# Altium project MARCS_PCB_Project.PrjPcb
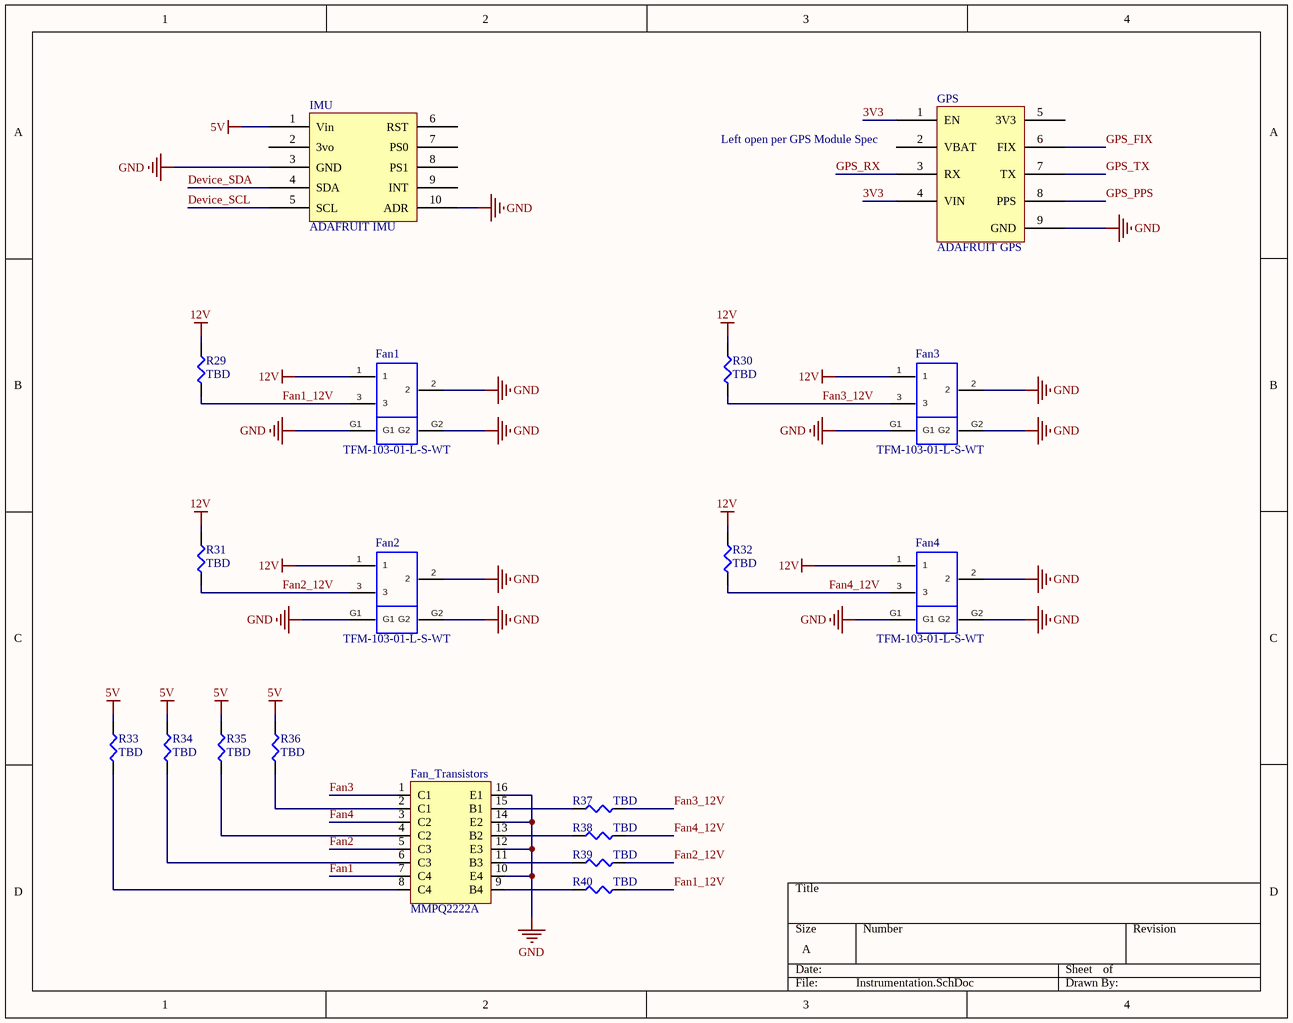
[diagram p0: Instrumentation.SchDoc]
6 sheets, 128 parts. Net scope: global (net labels, ports and power ports of the same name join across sheets).
Board file: MARCS.PcbDoc
Sheets:
  Instrumentation.SchDoc
  MotorControl_Sch.SchDoc
  Power.SchDoc
  PowerMonitoring.SchDoc
  Sensors_Sch.SchDoc
  STM32 Schematic V1.SchDoc

## Sheet Instrumentation.SchDoc
size A

### Parts
Fan1  TFM-103-01-L-S-WT  [TFM-103-01-L-S-WT]
Fan2  TFM-103-01-L-S-WT  [TFM-103-01-L-S-WT]
Fan3  TFM-103-01-L-S-WT  [TFM-103-01-L-S-WT]
Fan4  TFM-103-01-L-S-WT  [TFM-103-01-L-S-WT]
Fan_Transistors  MMPQ2222A  [MMPQ2222A]
GPS  ADAFRUIT GPS  [ADAFRUIT ULTIMATE GPS]
IMU  ADAFRUIT IMU  [ADAFRUIT IMU]
R29  TBD  [0805R-GENERIC]
R30  TBD  [0805R-GENERIC]
R31  TBD  [0805R-GENERIC]
R32  TBD  [0805R-GENERIC]
R33  TBD  [0805R-GENERIC]
R34  TBD  [0805R-GENERIC]
R35  TBD  [0805R-GENERIC]
R36  TBD  [0805R-GENERIC]
R37  TBD  [0805R-GENERIC]
R38  TBD  [0805R-GENERIC]
R39  TBD  [0805R-GENERIC]
R40  TBD  [0805R-GENERIC]

### Nets
3V3: GPS.1(EN) GPS.4(VIN)
5V: IMU.1(Vin) R33.1 R34.1 R35.1 R36.1
12V: Fan1.1 Fan2.1 Fan3.1 Fan4.1 R29.1 R30.1 R31.1 R32.1
GND: Fan1.2 Fan1.G1 Fan1.G2 Fan2.2 Fan2.G1 Fan2.G2 Fan3.2 Fan3.G1 Fan3.G2 Fan4.2 Fan4.G1 Fan4.G2 Fan_Transistors.10(E4) Fan_Transistors.12(E3) Fan_Transistors.14(E2) Fan_Transistors.16(E1) GPS.9(GND) IMU.3(GND) IMU.10(ADR)
Device_SCL: IMU.5(SCL)
Device_SDA: IMU.4(SDA)
Fan1: Fan_Transistors.7(C4)
Fan1_12V: Fan1.3 R29.2 R40.2
Fan2: Fan_Transistors.5(C3)
Fan2_12V: Fan2.3 R31.2 R39.2
Fan3: Fan_Transistors.1(C1)
Fan3_12V: Fan3.3 R30.2 R37.2
Fan4: Fan_Transistors.3(C2)
Fan4_12V: Fan4.3 R32.2 R38.2
GPS_FIX: GPS.6(FIX)
GPS_PPS: GPS.8(PPS)
GPS_RX: GPS.3(RX)
GPS_TX: GPS.7(TX)
NetFan_Transistors_2: Fan_Transistors.2(C1) R36.2
NetFan_Transistors_4: Fan_Transistors.4(C2) R35.2
NetFan_Transistors_6: Fan_Transistors.6(C3) R34.2
NetFan_Transistors_8: Fan_Transistors.8(C4) R33.2
NetFan_Transistors_9: Fan_Transistors.9(B4) R40.1
NetFan_Transistors_11: Fan_Transistors.11(B3) R39.1
NetFan_Transistors_13: Fan_Transistors.13(B2) R38.1
NetFan_Transistors_15: Fan_Transistors.15(B1) R37.1

Not connected (* = marked no-connect by the designer): GPS 2(VBAT) 5(3V3); IMU 2(3vo) 6(RST) 7(PS0) 8(PS1) 9(INT)

### Notes on the sheet
- (near GPS) Left open per GPS Module Spec

### Library data of the parts
R29-R40 = 0805R-TBD: RESISTOR 0805 VALUE TO BE DETERMINED
Fan_Transistors = MMPQ2222A: Supplier 1: Arrow; Supplier Part Number 1: MMPQ2222A
GPS = ADAFRUIT GPS: Supplier 1: Digi-Key; Supplier Part Number 1: 1528-1153-ND
IMU = ADAFRUIT IMU: Supplier 1: Arrow; Supplier Part Number 1: 2472

## Sheet MotorControl_Sch.SchDoc
size B
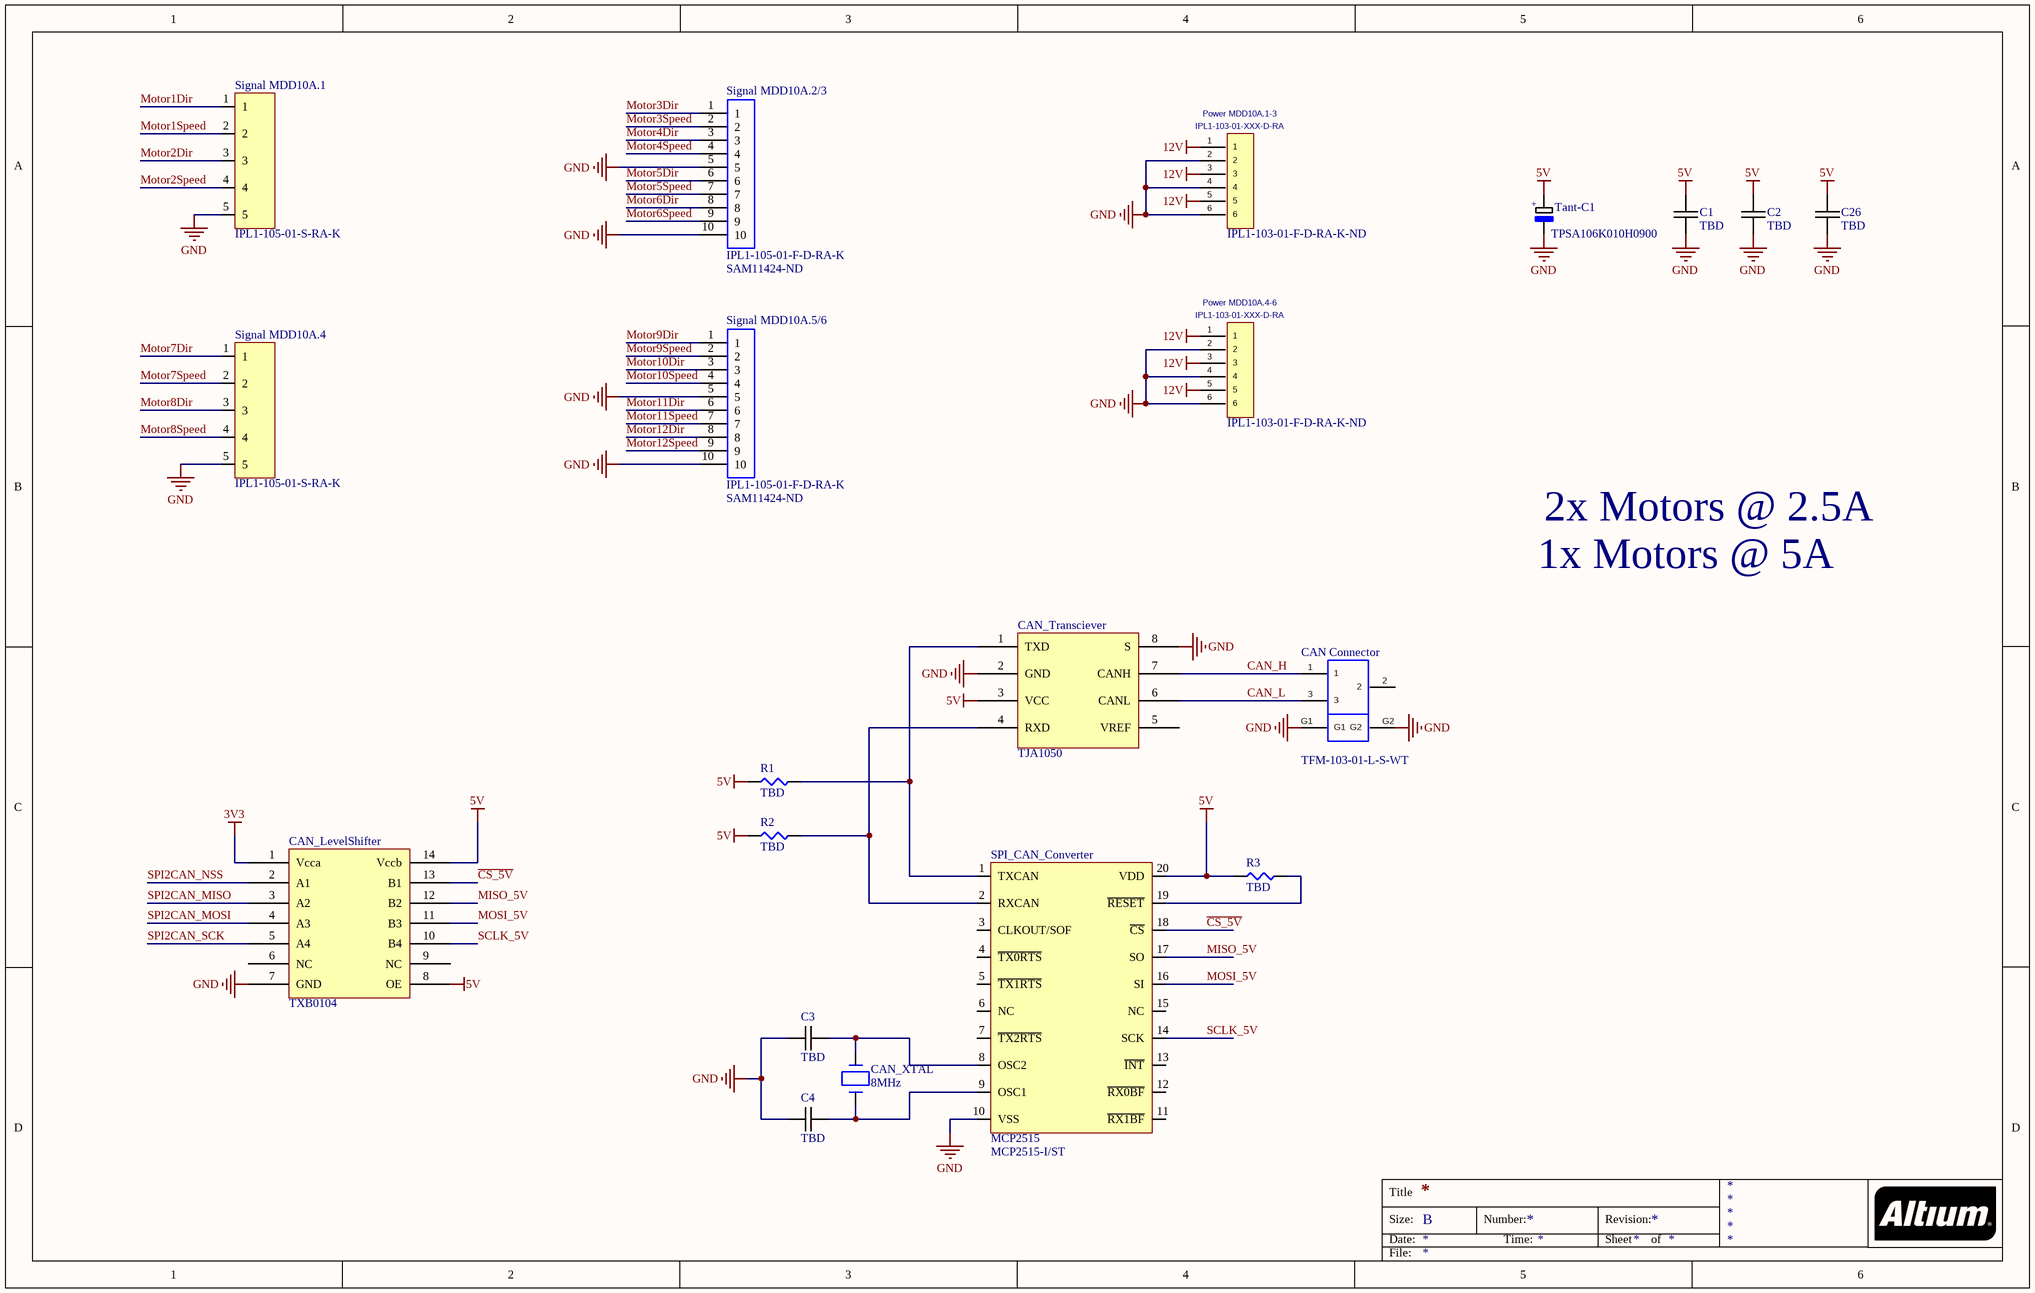
[diagram p1: MotorControl_Sch.SchDoc]

### Parts
C1  TBD  [0805C-GENERIC]
C2  TBD  [0805C-GENERIC]
C3  TBD  [0805C-GENERIC]
C4  TBD  [0805C-GENERIC]
C26  TBD  [0805C-GENERIC]
CAN_Connector  TFM-103-01-L-S-WT  [TFM-103-01-L-S-WT]
CAN_LevelShifter  TXB0104  [TXB0104]
CAN_Transciever  TJA1050  [TJA1050]
CAN_XTAL  8MHz  [GC0800044]
Power_MDD10A.1-3  IPL1-103-01-XXX-D-RA  Supplier Part Number 1: IPL1-103-01-F-D-RA-K-ND  [IPL1-103-01-XXX-D-RA]
Power_MDD10A.4-6  IPL1-103-01-XXX-D-RA  Supplier Part Number 1: IPL1-103-01-F-D-RA-K-ND  [IPL1-103-01-XXX-D-RA]
R1  TBD  [0805R-GENERIC]
R2  TBD  [0805R-GENERIC]
R3  TBD  [0805R-GENERIC]
Signal_MDD10A.1  IPL1-105-01-S-RA-K  [IPL1-105-01-S-RA-K]
Signal_MDD10A.2/3  IPL1-105-01-F-D-RA-K  Supplier Part Number 1: SAM11424-ND  [IPL1-105-01-F-D-RA-K]
Signal_MDD10A.4  IPL1-105-01-S-RA-K  [IPL1-105-01-S-RA-K]
Signal_MDD10A.5/6  IPL1-105-01-F-D-RA-K  Supplier Part Number 1: SAM11424-ND  [IPL1-105-01-F-D-RA-K]
SPI_CAN_Converter  MCP2515  Supplier Part Number 1: MCP2515-I/ST  [TSSOP20]
Tant-C1  TPSA106K010H0900  [TPSA106K010H0900]

### Nets
3V3: CAN_LevelShifter.1(Vcca)
5V: C1.1 C2.1 C26.1 CAN_LevelShifter.8(OE) CAN_LevelShifter.14(Vccb) CAN_Transciever.3(VCC) R1.1 R2.1 R3.1 SPI_CAN_Converter.20(VDD) Tant-C1.1(POS)
12V: Power_MDD10A.1-3.1 Power_MDD10A.1-3.3 Power_MDD10A.1-3.5 Power_MDD10A.4-6.1 Power_MDD10A.4-6.3 Power_MDD10A.4-6.5
GND: C1.2 C2.2 C3.1 C4.1 C26.2 CAN_Connector.G1 CAN_Connector.G2 CAN_LevelShifter.7(GND) CAN_Transciever.2(GND) CAN_Transciever.8(S) Power_MDD10A.1-3.2 Power_MDD10A.1-3.4 Power_MDD10A.1-3.6 Power_MDD10A.4-6.2 Power_MDD10A.4-6.4 Power_MDD10A.4-6.6 Signal_MDD10A.1.5 Signal_MDD10A.2/3.5 Signal_MDD10A.2/3.10 Signal_MDD10A.4.5 Signal_MDD10A.5/6.5 Signal_MDD10A.5/6.10 SPI_CAN_Converter.10(VSS) Tant-C1.2(NEG)
~{CS_5V}: CAN_LevelShifter.13(B1) SPI_CAN_Converter.18(~{CS})
CAN_H: CAN_Connector.1 CAN_Transciever.7(CANH)
CAN_L: CAN_Connector.3 CAN_Transciever.6(CANL)
MISO_5V: CAN_LevelShifter.12(B2) SPI_CAN_Converter.17(SO)
MOSI_5V: CAN_LevelShifter.11(B3) SPI_CAN_Converter.16(SI)
Motor1Dir: Signal_MDD10A.1.1
Motor1Speed: Signal_MDD10A.1.2
Motor2Dir: Signal_MDD10A.1.3
Motor2Speed: Signal_MDD10A.1.4
Motor3Dir: Signal_MDD10A.2/3.1
Motor3Speed: Signal_MDD10A.2/3.2
Motor4Dir: Signal_MDD10A.2/3.3
Motor4Speed: Signal_MDD10A.2/3.4
Motor5Dir: Signal_MDD10A.2/3.6
Motor5Speed: Signal_MDD10A.2/3.7
Motor6Dir: Signal_MDD10A.2/3.8
Motor6Speed: Signal_MDD10A.2/3.9
Motor7Dir: Signal_MDD10A.4.1
Motor7Speed: Signal_MDD10A.4.2
Motor8Dir: Signal_MDD10A.4.3
Motor8Speed: Signal_MDD10A.4.4
Motor9Dir: Signal_MDD10A.5/6.1
Motor9Speed: Signal_MDD10A.5/6.2
Motor10Dir: Signal_MDD10A.5/6.3
Motor10Speed: Signal_MDD10A.5/6.4
Motor11Dir: Signal_MDD10A.5/6.6
Motor11Speed: Signal_MDD10A.5/6.7
Motor12Dir: Signal_MDD10A.5/6.8
Motor12Speed: Signal_MDD10A.5/6.9
SCLK_5V: CAN_LevelShifter.10(B4) SPI_CAN_Converter.14(SCK)
SPI2CAN_MISO: CAN_LevelShifter.3(A2)
SPI2CAN_MOSI: CAN_LevelShifter.4(A3)
SPI2CAN_NSS: CAN_LevelShifter.2(A1)
SPI2CAN_SCK: CAN_LevelShifter.5(A4)
NetC3_2: C3.2 CAN_XTAL.1 SPI_CAN_Converter.8(OSC2)
NetC4_2: C4.2 CAN_XTAL.2 SPI_CAN_Converter.9(OSC1)
NetCAN_Transciever_1: CAN_Transciever.1(TXD) R1.2 SPI_CAN_Converter.1(TXCAN)
NetCAN_Transciever_4: CAN_Transciever.4(RXD) R2.2 SPI_CAN_Converter.2(RXCAN)
NetR3_2: R3.2 SPI_CAN_Converter.19(~{RESET})

Not connected (* = marked no-connect by the designer): CAN_Connector 2; CAN_LevelShifter 6(NC) 9(NC); CAN_Transciever 5(VREF); SPI_CAN_Converter 3(CLKOUT/SOF) 4(~{TX0RTS}) 5(~{TX1RTS}) 6(NC) 7(~{TX2RTS}) 11(~{RX1BF}) 12(~{RX0BF}) 13(~{INT}) 15(NC)

### Notes on the sheet
- 2x Motors @ 2.5A
- 1x Motors @ 5A
- Title
- Size:
- Date:
- B
- Number:
- Time:
- Revision:
- Sheet
- of
- File:
- (in symbol TPSA106K010H0900) +

### Library data of the parts
C1-C4 C26 = 0805C-TBD: CAPACITOR 0805 CERAMIC VALUE TO BE DETERMINED
CAN_XTAL = GC0800044: Diodes Incorporated GC0800044; Supplier 1: Digi-Key; Supplier Part Number 1: GC0800044TR-ND
Power_MDD10A.1-3 Power_MDD10A.4-6 = IPL1-103-01-XXX-D-RA: Terminal Assembly, Double Row, Right Angle, Thru-Hole, 0.100" x 0.100" Pitch, 6Pins; MANUFACTURER: SAMTEC; CREATED: July 16, 2014 - Wendy Xin; PCB DECAL: IPL1-103-01-XXX-D-RA; Supplier 1: Digi-Key
R1-R3 = 0805R-TBD: RESISTOR 0805 VALUE TO BE DETERMINED
Signal_MDD10A.2/3 Signal_MDD10A.5/6 = IPL1-105-01-F-D-RA-K: Supplier 1: Digi-Key
SPI_CAN_Converter = MCP2515: Supplier 1: Arrow

## Sheet Power.SchDoc
size B
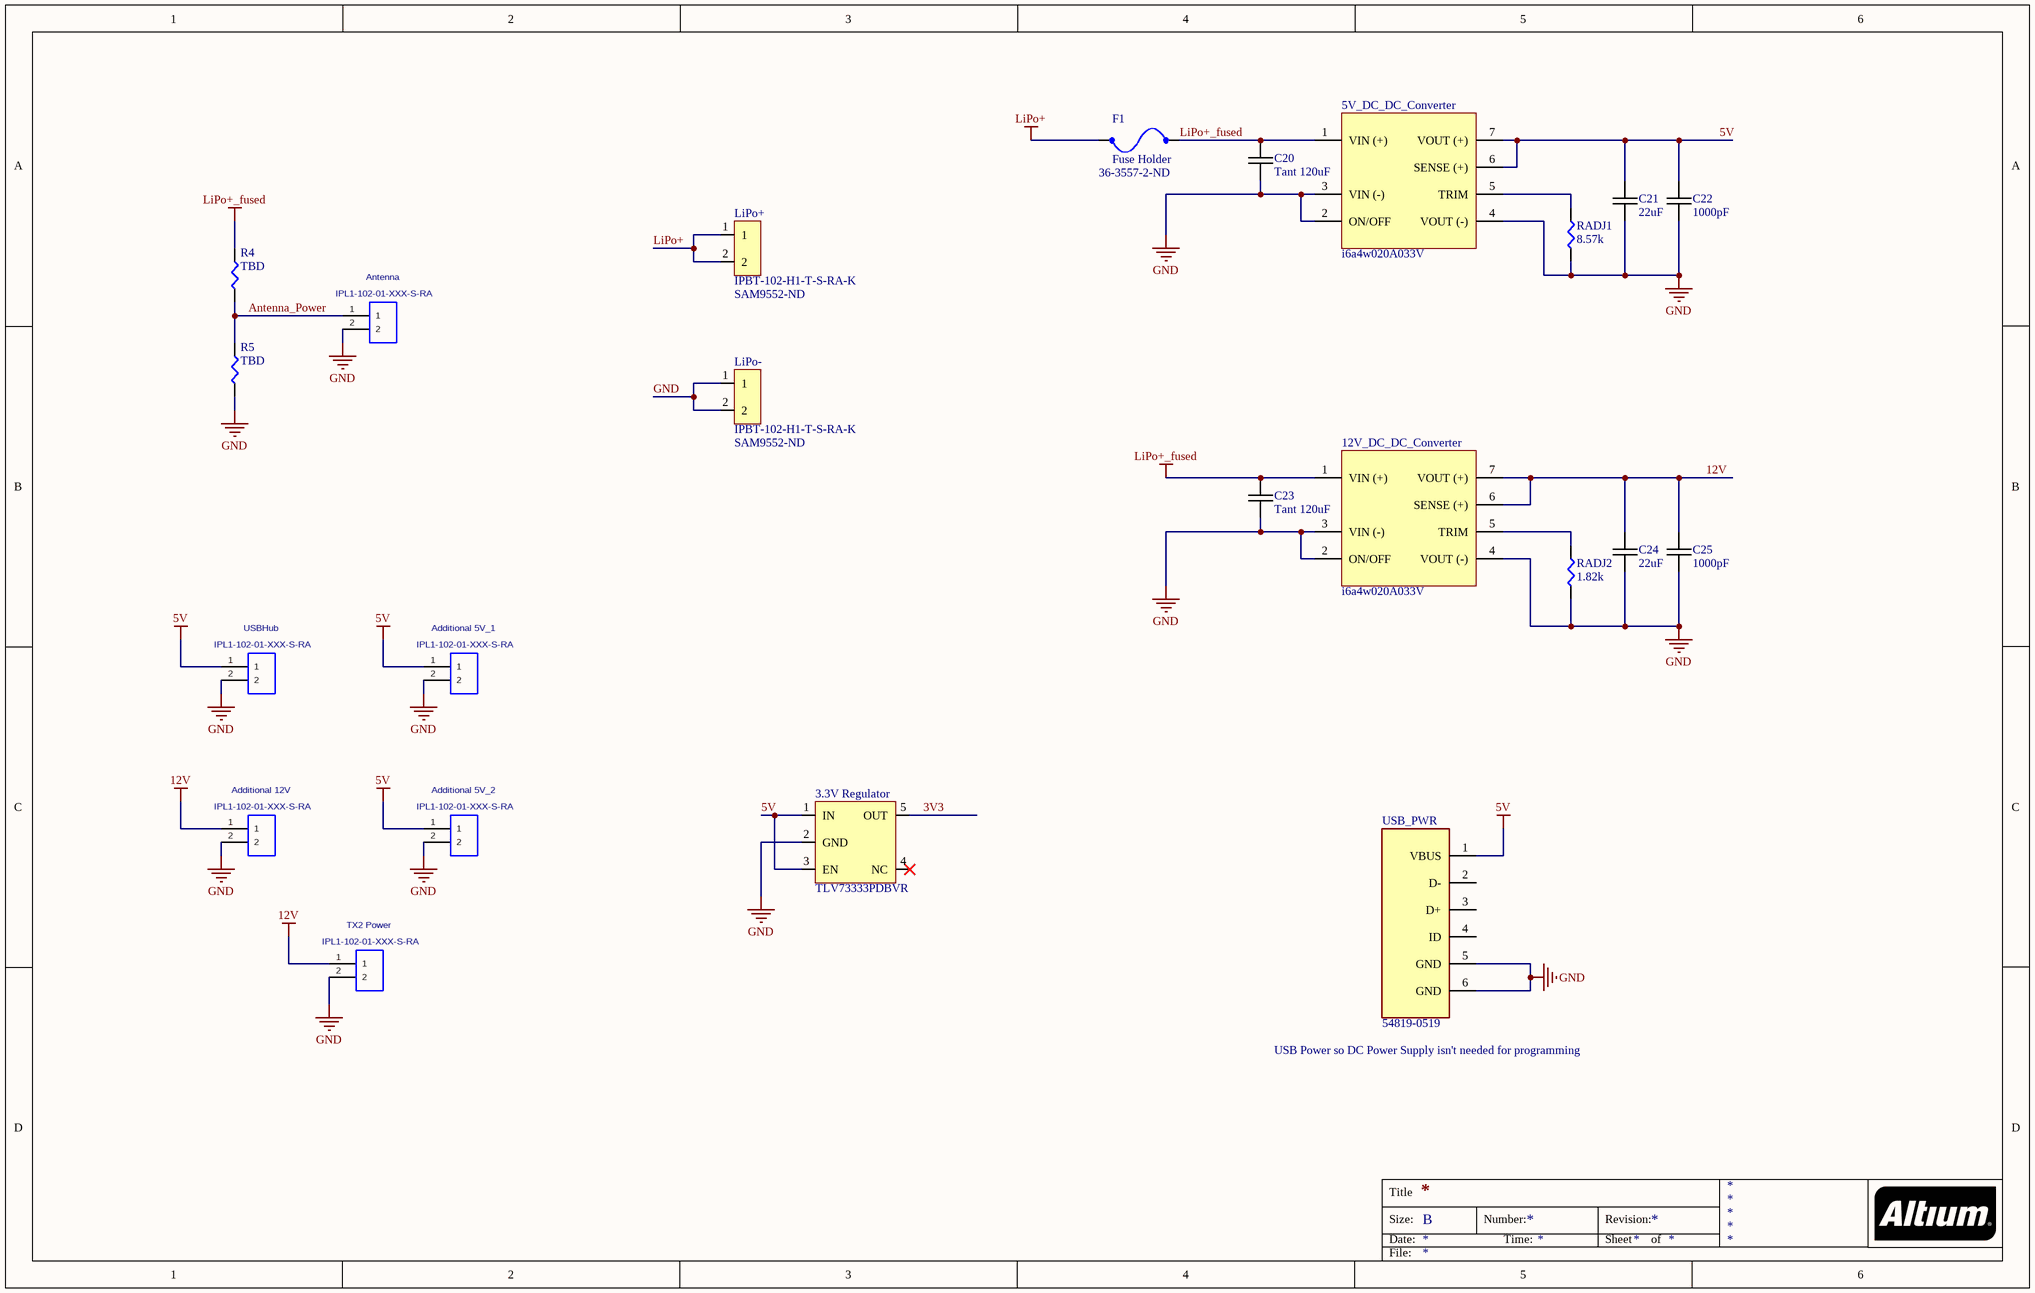
[diagram p2: Power.SchDoc]

### Parts
3.3V_Regulator  TLV73333PDBVR  [TLV733P]
5V_DC_DC_Converter  i6a4w020A033V  [i6a4w020A033V-001-R]
12V_DC_DC_Converter  i6a4w020A033V  [i6a4w020A033V-001-R]
Additional_5V_1  IPL1-102-01-XXX-S-RA  [IPL1-102-01-XXX-S-RA]
Additional_5V_2  IPL1-102-01-XXX-S-RA  [IPL1-102-01-XXX-S-RA]
Additional_12V  IPL1-102-01-XXX-S-RA  [IPL1-102-01-XXX-S-RA]
Antenna  IPL1-102-01-XXX-S-RA  [IPL1-102-01-XXX-S-RA]
C20  Tant 120uF  [0805C-GENERIC]
C21  22uF  [0805C-GENERIC]
C22  1000pF  [0805C-GENERIC]
C23  Tant 120uF  [0805C-GENERIC]
C24  22uF  [0805C-GENERIC]
C25  1000pF  [0805C-GENERIC]
F1  Fuse Holder  Supplier Part Number 1: 36-3557-2-ND  [Fuse Holder]
LiPo+  IPBT-102-H1-T-S-RA-K  Supplier Part Number 1: SAM9552-ND  [IPBT-102-H1-T-S-RA-K]
LiPo-  IPBT-102-H1-T-S-RA-K  Supplier Part Number 1: SAM9552-ND  [IPBT-102-H1-T-S-RA-K]
R4  TBD  [0805R-GENERIC]
R5  TBD  [0805R-GENERIC]
RADJ1  8.57k  [0805R-GENERIC]
RADJ2  1.82k  [0805R-GENERIC]
TX2_Power  IPL1-102-01-XXX-S-RA  [IPL1-102-01-XXX-S-RA]
USB_PWR  Part Number: 54819-0519  [Molex_54819-0519_0]  (hidden comment: Conn_Molex_54819-0519_eec)
USBHub  IPL1-102-01-XXX-S-RA  [IPL1-102-01-XXX-S-RA]

### Nets
3V3: 3.3V_Regulator.5(OUT)
5V: 3.3V_Regulator.1(IN) 3.3V_Regulator.3(EN) 5V_DC_DC_Converter.6(SENSE_(+)) 5V_DC_DC_Converter.7(VOUT_(+)) Additional_5V_1.1 Additional_5V_2.1 C21.1 C22.1 USB_PWR.1(VBUS) USBHub.1
12V: 12V_DC_DC_Converter.6(SENSE_(+)) 12V_DC_DC_Converter.7(VOUT_(+)) Additional_12V.1 C24.1 C25.1 TX2_Power.1
GND: 3.3V_Regulator.2(GND) 5V_DC_DC_Converter.2(ON/OFF) 5V_DC_DC_Converter.3(VIN_(-)) 5V_DC_DC_Converter.4(VOUT_(-)) 12V_DC_DC_Converter.2(ON/OFF) 12V_DC_DC_Converter.3(VIN_(-)) 12V_DC_DC_Converter.4(VOUT_(-)) Additional_5V_1.2 Additional_5V_2.2 Additional_12V.2 Antenna.2 C20.2 C21.2 C22.2 C23.2 C24.2 C25.2 LiPo-.1 LiPo-.2 R5.1 RADJ1.2 RADJ2.2 TX2_Power.2 USB_PWR.5(GND) USB_PWR.6(GND) USBHub.2
LiPo+: F1.1 LiPo+.1 LiPo+.2
LiPo+_fused: 5V_DC_DC_Converter.1(VIN_(+)) 12V_DC_DC_Converter.1(VIN_(+)) C20.1 C23.1 F1.2 R4.2
Antenna_Power: Antenna.1 R4.1 R5.2
Net5V_DC_DC_Converter_5: 5V_DC_DC_Converter.5(TRIM) RADJ1.1
Net12V_DC_DC_Converter_5: 12V_DC_DC_Converter.5(TRIM) RADJ2.1

Not connected (* = marked no-connect by the designer): 3.3V_Regulator 4(NC)*; USB_PWR 2(D-) 3(D+) 4(ID)

### Notes on the sheet
- USB Power so DC Power Supply isn't needed for programming
- Title
- Size:
- Date:
- B
- Number:
- Time:
- Revision:
- Sheet
- of
- File:

### Library data of the parts
3.3V_Regulator = TLV733
5V_DC_DC_Converter 12V_DC_DC_Converter = i6a4w020A033V-001-R: TDK-Lambda DC/DC Converter; Supplier 1: Digi-Key; Supplier Part Number 1: i6a4w020A033V
Additional_5V_1 Additional_5V_2 Additional_12V Antenna TX2_Power USBHub = IPL1-102-01-XXX-S-RA: Terminal Assembly, Single Row, Right Angle, Thru-Hole, 2 Pins.; MANUFACTURER: SAMTEC; CREATED: February 14, 2016 - Wendy Xin; PCB DECAL: IPL1-102-01-XXX-S-RA
C20-C25 = 0805C-TBD: as C1 on sheet MotorControl_Sch
R4 R5 RADJ1 RADJ2 = 0805R-TBD: RESISTOR 0805 VALUE TO BE DETERMINED
USB_PWR = Conn_Molex_54819-0519_eec: CONN USB - mini B USB 2.0 OTG Receptacle Connector 5 Position Through Hole, Right Angle; Manufacturer: Molex; Is Female: yes; helpURL: https://upverter.com/upn/revision/57f7d65304c3d878/; ComponentLink2Description: Datasheet; Temperature: -20°C to +85°C; Package: CONN_PTH_7MM7_9MM0_USB; Supplier 2: Mouser; Supplier 1: Digi-Key; ComponentLink1URL: https://upverter.com/upn/revision/57f7d65304c3d878/; Supplier Part Number 2: 538-54819-0519; Supplier Part Number 1: WM17115-ND; ComponentLink1Description: Upverter; ComponentLink2URL: https://upverter.com/datasheet/9d71f2f8719b3fc0715bd6f9e6d9d5a5d296bb87.pdf; RoHS: TRUE; Mouser Part Number: 538-54819-0519; Temperature Range High: +85°C; Digikey Description: CONN USB - mini B USB 2.0 OTG Receptacle Connector 5 Position Through Hole, Right Angle; Digikey Part Number: WM17115-ND; Lead Free: yes; Temperature Range Low: -20°C
F1 = Fuse Holder: Supplier 1: Digi-Key
LiPo+ LiPo- = IPBT-102-H1-T-S-RA-K: Supplier 1: Digi-Key

## Sheet PowerMonitoring.SchDoc
size B
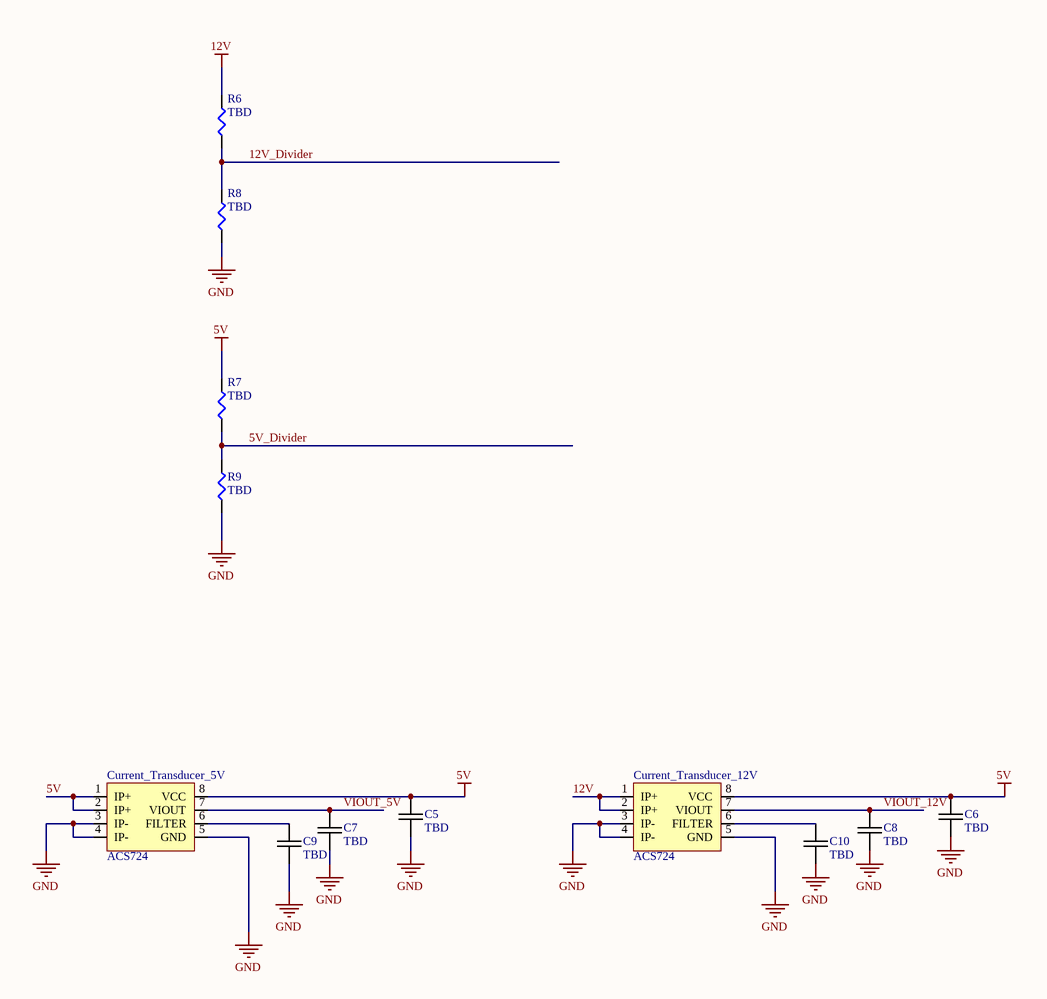
[diagram p3: PowerMonitoring.SchDoc]

### Parts
C5  TBD  [0805C-GENERIC]
C6  TBD  [0805C-GENERIC]
C7  TBD  [0805C-GENERIC]
C8  TBD  [0805C-GENERIC]
C9  TBD  [0805C-GENERIC]
C10  TBD  [0805C-GENERIC]
Current_Transducer_5V  ACS724  [SOIC-8 V3]
Current_Transducer_12V  ACS724  [SOIC-8 V3]
R6  TBD  [0805R-GENERIC]
R7  TBD  [0805R-GENERIC]
R8  TBD  [0805R-GENERIC]
R9  TBD  [0805R-GENERIC]

### Nets
5V: C5.1 C6.1 Current_Transducer_5V.1(IP+) Current_Transducer_5V.2(IP+) Current_Transducer_5V.8(VCC) Current_Transducer_12V.8(VCC) R7.2
12V: Current_Transducer_12V.1(IP+) Current_Transducer_12V.2(IP+) R6.2
GND: C5.2 C6.2 C7.2 C8.2 C9.2 C10.2 Current_Transducer_5V.3(IP-) Current_Transducer_5V.4(IP-) Current_Transducer_5V.5(GND) Current_Transducer_12V.3(IP-) Current_Transducer_12V.4(IP-) Current_Transducer_12V.5(GND) R8.1 R9.2
5V_Divider: R7.1 R9.1
12V_Divider: R6.1 R8.2
VIOUT_5V: C7.1 Current_Transducer_5V.7(VIOUT)
VIOUT_12V: C8.1 Current_Transducer_12V.7(VIOUT)
NetC9_1: C9.1 Current_Transducer_5V.6(FILTER)
NetC10_1: C10.1 Current_Transducer_12V.6(FILTER)

### Notes on the sheet
- Title
- Size:
- Date:
- B
- Number:
- Time:
- Revision:
- Sheet
- of
- File:

### Library data of the parts
C5-C10 = 0805C-TBD: as C1 on sheet MotorControl_Sch
R6-R9 = 0805R-TBD: RESISTOR 0805 VALUE TO BE DETERMINED

## Sheet Sensors_Sch.SchDoc
size B
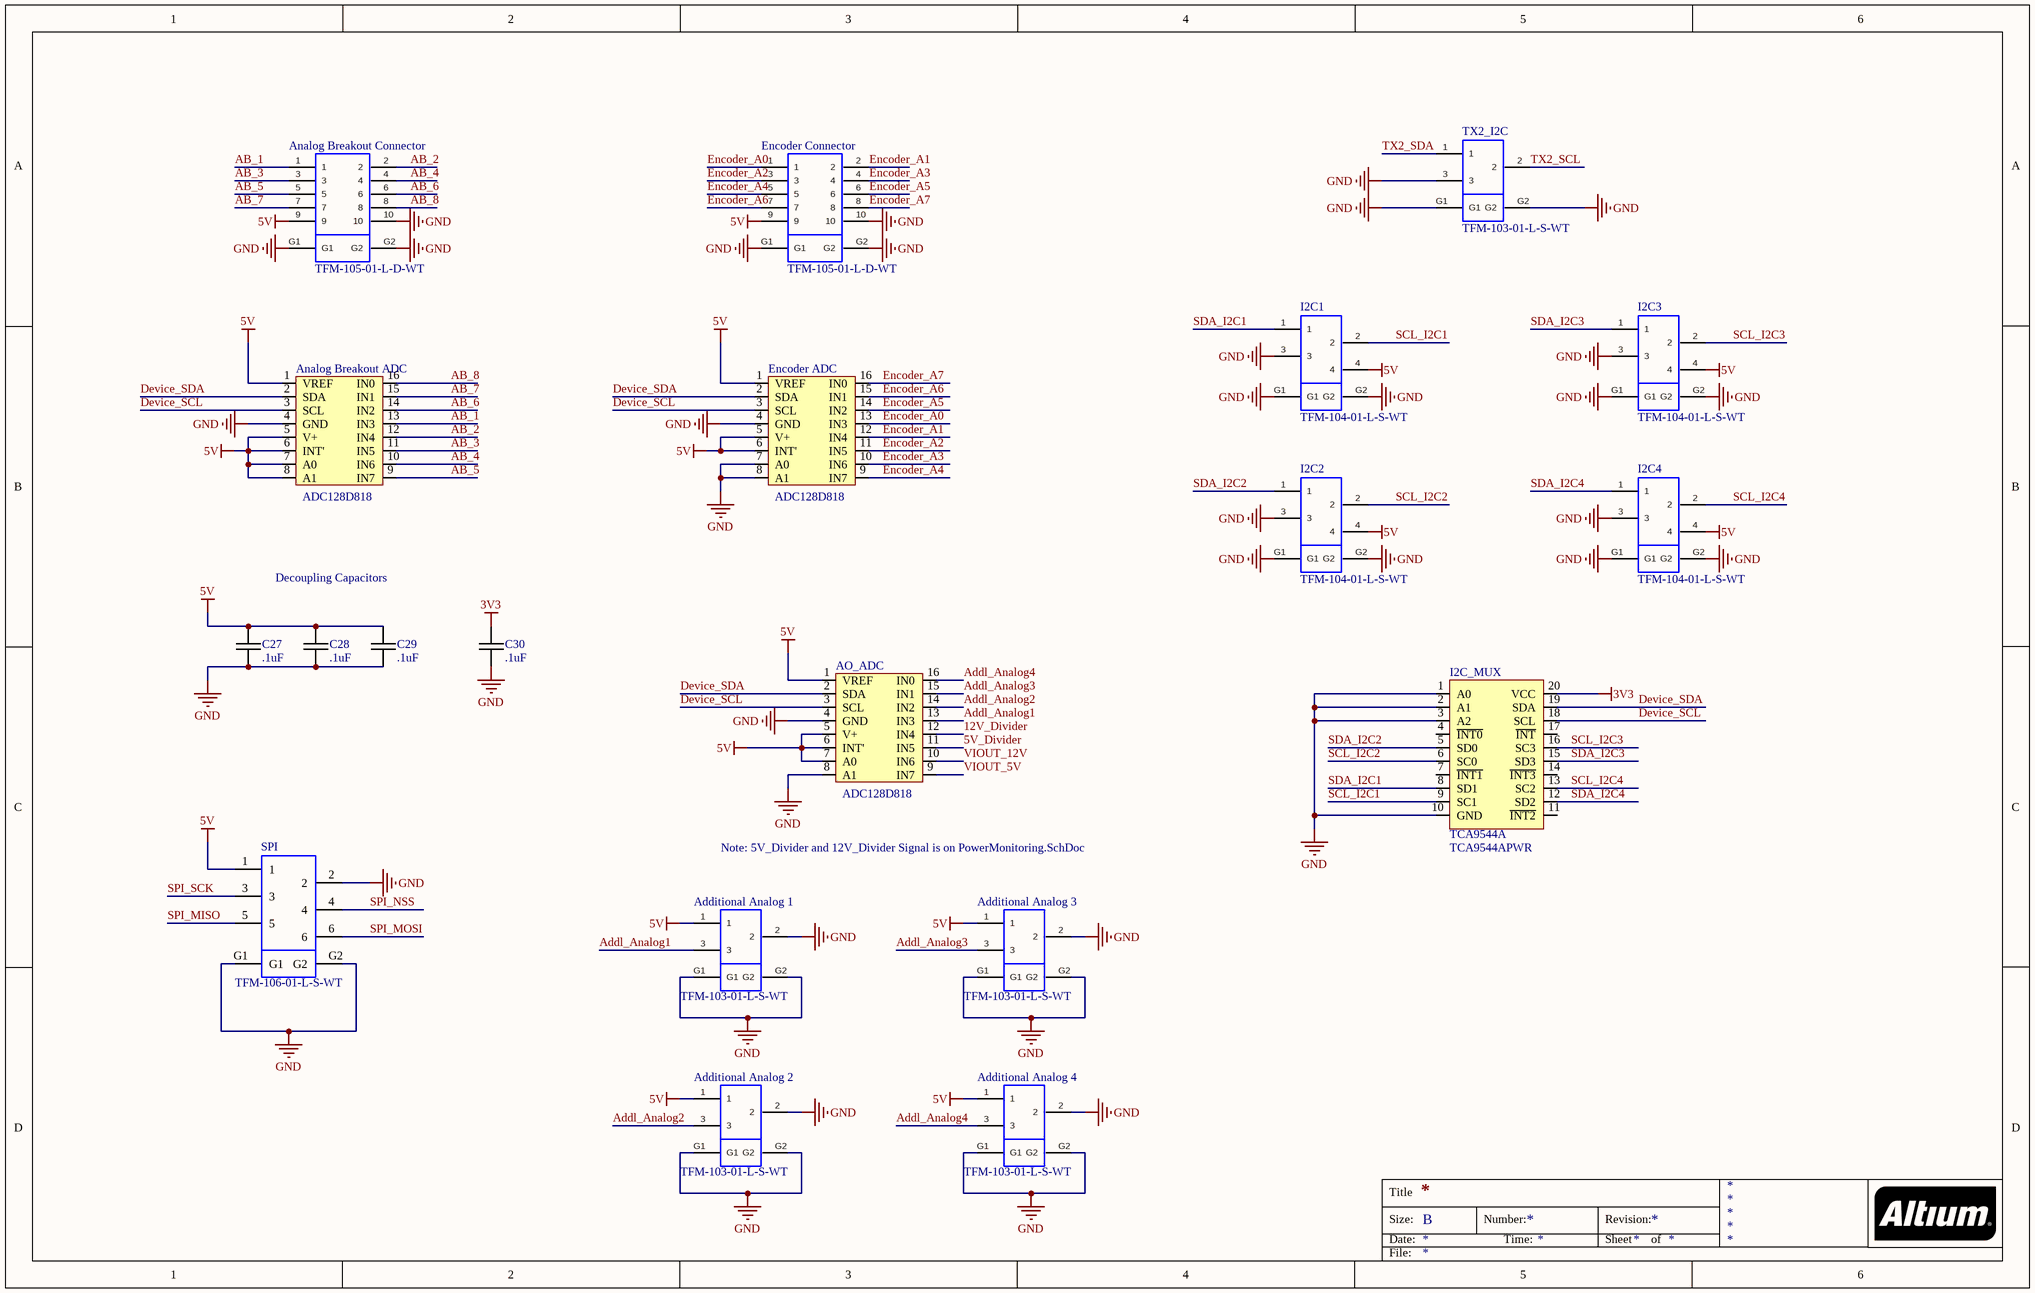
[diagram p4: Sensors_Sch.SchDoc]

### Parts
Additional_Analog_1  TFM-103-01-L-S-WT  [TFM-103-01-L-S-WT]
Additional_Analog_2  TFM-103-01-L-S-WT  [TFM-103-01-L-S-WT]
Additional_Analog_3  TFM-103-01-L-S-WT  [TFM-103-01-L-S-WT]
Additional_Analog_4  TFM-103-01-L-S-WT  [TFM-103-01-L-S-WT]
Analog_Breakout_ADC  ADC128D818  [ADC128D818 V3]
Analog_Breakout_Connector  TFM-105-01-L-D-WT  [TFM-105-01-L-D-WT]
AO_ADC  ADC128D818  [ADC128D818 V3]
C27  .1uF  [0805C-GENERIC]
C28  .1uF  [0805C-GENERIC]
C29  .1uF  [0805C-GENERIC]
C30  .1uF  [0805C-GENERIC]
Encoder_ADC  ADC128D818  [ADC128D818 V3]
Encoder_Connector  TFM-105-01-L-D-WT  [TFM-105-01-L-D-WT]
I2C1  TFM-104-01-L-S-WT  [TFM-104-01-L-S-WT]
I2C2  TFM-104-01-L-S-WT  [TFM-104-01-L-S-WT]
I2C3  TFM-104-01-L-S-WT  [TFM-104-01-L-S-WT]
I2C4  TFM-104-01-L-S-WT  [TFM-104-01-L-S-WT]
I2C_MUX  TCA9544A  Supplier Part Number 1: TCA9544APWR  [TSSOP20]
SPI  TFM-106-01-L-S-WT  [TFM-106-01-L-S-WT]
TX2_I2C  TFM-103-01-L-S-WT  [TFM-103-01-L-S-WT]

### Nets
3V3: C30.1 I2C_MUX.20(VCC)
5V: Additional_Analog_1.1 Additional_Analog_2.1 Additional_Analog_3.1 Additional_Analog_4.1 Analog_Breakout_ADC.1(VREF) Analog_Breakout_ADC.5(V+) Analog_Breakout_ADC.6(INT') Analog_Breakout_ADC.7(A0) Analog_Breakout_ADC.8(A1) Analog_Breakout_Connector.9 AO_ADC.1(VREF) AO_ADC.5(V+) AO_ADC.6(INT') AO_ADC.7(A0) C27.1 C28.1 C29.1 Encoder_ADC.1(VREF) Encoder_ADC.5(V+) Encoder_ADC.6(INT') Encoder_Connector.9 I2C1.4 I2C2.4 I2C3.4 I2C4.4 SPI.1
GND: Additional_Analog_1.2 Additional_Analog_1.G1 Additional_Analog_1.G2 Additional_Analog_2.2 Additional_Analog_2.G1 Additional_Analog_2.G2 Additional_Analog_3.2 Additional_Analog_3.G1 Additional_Analog_3.G2 Additional_Analog_4.2 Additional_Analog_4.G1 Additional_Analog_4.G2 Analog_Breakout_ADC.4(GND) Analog_Breakout_Connector.10 Analog_Breakout_Connector.G1 Analog_Breakout_Connector.G2 AO_ADC.4(GND) AO_ADC.8(A1) C27.2 C28.2 C29.2 C30.2 Encoder_ADC.4(GND) Encoder_ADC.7(A0) Encoder_ADC.8(A1) Encoder_Connector.10 Encoder_Connector.G1 Encoder_Connector.G2 I2C1.3 I2C1.G1 I2C1.G2 I2C2.3 I2C2.G1 I2C2.G2 I2C3.3 I2C3.G1 I2C3.G2 I2C4.3 I2C4.G1 I2C4.G2 I2C_MUX.1(A0) I2C_MUX.2(A1) I2C_MUX.3(A2) I2C_MUX.10(GND) SPI.2 SPI.G1 SPI.G2 TX2_I2C.3 TX2_I2C.G1 TX2_I2C.G2
5V_Divider: AO_ADC.11(IN5)
12V_Divider: AO_ADC.12(IN4)
AB_1: Analog_Breakout_ADC.13(IN3) Analog_Breakout_Connector.1
AB_2: Analog_Breakout_ADC.12(IN4) Analog_Breakout_Connector.2
AB_3: Analog_Breakout_ADC.11(IN5) Analog_Breakout_Connector.3
AB_4: Analog_Breakout_ADC.10(IN6) Analog_Breakout_Connector.4
AB_5: Analog_Breakout_ADC.9(IN7) Analog_Breakout_Connector.5
AB_6: Analog_Breakout_ADC.14(IN2) Analog_Breakout_Connector.6
AB_7: Analog_Breakout_ADC.15(IN1) Analog_Breakout_Connector.7
AB_8: Analog_Breakout_ADC.16(IN0) Analog_Breakout_Connector.8
Addl_Analog1: Additional_Analog_1.3 AO_ADC.13(IN3)
Addl_Analog2: Additional_Analog_2.3 AO_ADC.14(IN2)
Addl_Analog3: Additional_Analog_3.3 AO_ADC.15(IN1)
Addl_Analog4: Additional_Analog_4.3 AO_ADC.16(IN0)
Device_SCL: Analog_Breakout_ADC.3(SCL) AO_ADC.3(SCL) Encoder_ADC.3(SCL) I2C_MUX.18(SCL)
Device_SDA: Analog_Breakout_ADC.2(SDA) AO_ADC.2(SDA) Encoder_ADC.2(SDA) I2C_MUX.19(SDA)
Encoder_A0: Encoder_ADC.13(IN3) Encoder_Connector.1
Encoder_A1: Encoder_ADC.12(IN4) Encoder_Connector.2
Encoder_A2: Encoder_ADC.11(IN5) Encoder_Connector.3
Encoder_A3: Encoder_ADC.10(IN6) Encoder_Connector.4
Encoder_A4: Encoder_ADC.9(IN7) Encoder_Connector.5
Encoder_A5: Encoder_ADC.14(IN2) Encoder_Connector.6
Encoder_A6: Encoder_ADC.15(IN1) Encoder_Connector.7
Encoder_A7: Encoder_ADC.16(IN0) Encoder_Connector.8
SCL_I2C1: I2C1.2 I2C_MUX.9(SC1)
SCL_I2C2: I2C2.2 I2C_MUX.6(SC0)
SCL_I2C3: I2C3.2 I2C_MUX.16(SC3)
SCL_I2C4: I2C4.2 I2C_MUX.13(SC2)
SDA_I2C1: I2C1.1 I2C_MUX.8(SD1)
SDA_I2C2: I2C2.1 I2C_MUX.5(SD0)
SDA_I2C3: I2C3.1 I2C_MUX.15(SD3)
SDA_I2C4: I2C4.1 I2C_MUX.12(SD2)
SPI_MISO: SPI.5
SPI_MOSI: SPI.6
SPI_NSS: SPI.4
SPI_SCK: SPI.3
TX2_SCL: TX2_I2C.2
TX2_SDA: TX2_I2C.1
VIOUT_5V: AO_ADC.9(IN7)
VIOUT_12V: AO_ADC.10(IN6)

Not connected (* = marked no-connect by the designer): I2C_MUX 4(~{INT0}) 7(~{INT1}) 11(~{INT2}) 14(~{INT3}) 17(~{INT})

### Notes on the sheet
- Decoupling Capacitors
- Note: 5V_Divider and 12V_Divider Signal is on PowerMonitoring.SchDoc
- Title
- Size:
- Date:
- B
- Number:
- Time:
- Revision:
- Sheet
- of
- File:

### Library data of the parts
C27-C30 = 0805C-TBD: as C1 on sheet MotorControl_Sch
I2C_MUX = TCA9544A: Supplier 1: Arrow Electronics, Inc.
SPI = TFM-106-01-L-S-WT: Supplier 1: Digi-Key; Supplier Part Number 1: TFM-106-01-L-S-WT

## Sheet STM32 Schematic V1.SchDoc
size B
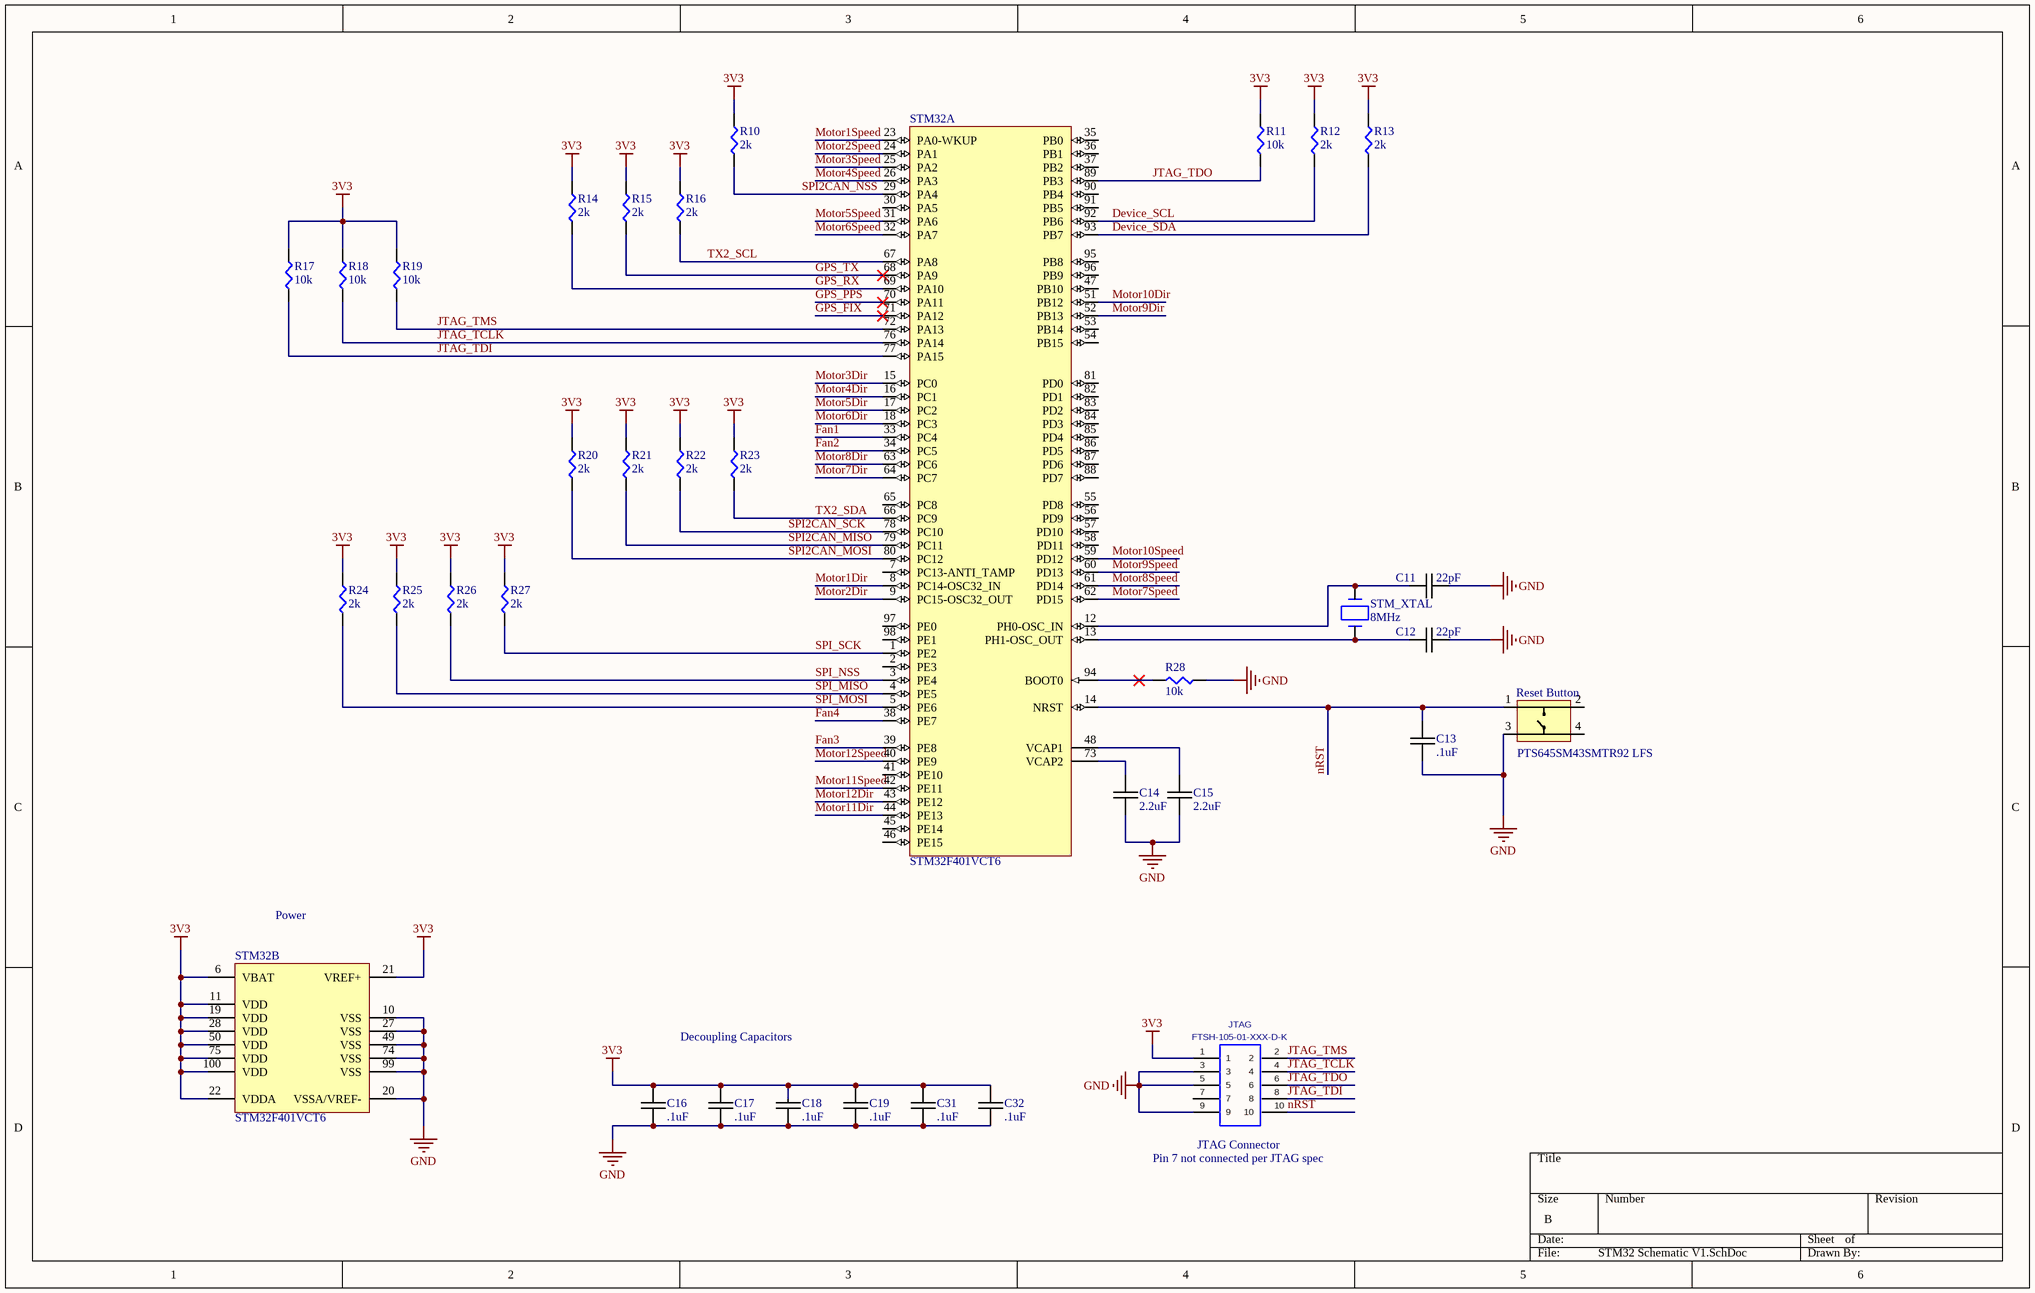
[diagram p5: STM32 Schematic V1.SchDoc]

### Parts
C11  22pF  [0805C-GENERIC]
C12  22pF  [0805C-GENERIC]
C13  .1uF  [0805C-GENERIC]
C14  2.2uF  [0805C-GENERIC]
C15  2.2uF  [0805C-GENERIC]
C16  .1uF  [0805C-GENERIC]
C17  .1uF  [0805C-GENERIC]
C18  .1uF  [0805C-GENERIC]
C19  .1uF  [0805C-GENERIC]
C31  .1uF  [0805C-GENERIC]
C32  .1uF  [0805C-GENERIC]
JTAG  FTSH-105-01-XXX-D-K  [FTSH-105-01-XXX-D-K]
R10  2k  [0805R-GENERIC]
R11  10k  [0805R-GENERIC]
R12  2k  [0805R-GENERIC]
R13  2k  [0805R-GENERIC]
R14  2k  [0805R-GENERIC]
R15  2k  [0805R-GENERIC]
R16  2k  [0805R-GENERIC]
R17  10k  [0805R-GENERIC]
R18  10k  [0805R-GENERIC]
R19  10k  [0805R-GENERIC]
R20  2k  [0805R-GENERIC]
R21  2k  [0805R-GENERIC]
R22  2k  [0805R-GENERIC]
R23  2k  [0805R-GENERIC]
R24  2k  [0805R-GENERIC]
R25  2k  [0805R-GENERIC]
R26  2k  [0805R-GENERIC]
R27  2k  [0805R-GENERIC]
R28  10k  [0805R-GENERIC]
Reset_Button  PTS645SM43SMTR92 LFS  [PTS645SM43SMTR92 LFS]
STM32  STM32F401VCT6  [STM-LQFP100_V]  (parts A,B of 2)
STM_XTAL  8MHz  [GC0800044]

### Nets
3V3: C16.1 C17.1 C18.1 C19.1 C31.1 C32.1 JTAG.1 R10.1 R11.1 R12.1 R13.1 R14.1 R15.1 R16.1 R17.1 R18.1 R19.1 R20.1 R21.1 R22.1 R23.1 R24.1 R25.1 R26.1 R27.1 STM32.6(VBAT) STM32.11(VDD) STM32.19(VDD) STM32.21(VREF+) STM32.22(VDDA) STM32.28(VDD) STM32.50(VDD) STM32.75(VDD) STM32.100(VDD)
GND: C11.2 C12.2 C13.2 C14.2 C15.2 C16.2 C17.2 C18.2 C19.2 C31.2 C32.2 JTAG.3 JTAG.5 JTAG.9 R28.2 Reset_Button.3 STM32.10(VSS) STM32.20(VSSA/VREF-) STM32.27(VSS) STM32.49(VSS) STM32.74(VSS) STM32.99(VSS)
Device_SCL: R12.2 STM32.92(PB6)
Device_SDA: R13.2 STM32.93(PB7)
Fan1: STM32.33(PC4)
Fan2: STM32.34(PC5)
Fan3: STM32.39(PE8)
Fan4: STM32.38(PE7)
GPS_FIX: STM32.71(PA12)
GPS_PPS: STM32.70(PA11)
GPS_RX: R14.2 STM32.69(PA10)
GPS_TX: R15.2 STM32.68(PA9)
JTAG_TCLK: JTAG.4 R18.2 STM32.76(PA14)
JTAG_TDI: JTAG.8 R17.2 STM32.77(PA15)
JTAG_TDO: JTAG.6 R11.2 STM32.89(PB3)
JTAG_TMS: JTAG.2 R19.2 STM32.72(PA13)
Motor1Dir: STM32.8(PC14-OSC32_IN)
Motor1Speed: STM32.23(PA0-WKUP)
Motor2Dir: STM32.9(PC15-OSC32_OUT)
Motor2Speed: STM32.24(PA1)
Motor3Dir: STM32.15(PC0)
Motor3Speed: STM32.25(PA2)
Motor4Dir: STM32.16(PC1)
Motor4Speed: STM32.26(PA3)
Motor5Dir: STM32.17(PC2)
Motor5Speed: STM32.31(PA6)
Motor6Dir: STM32.18(PC3)
Motor6Speed: STM32.32(PA7)
Motor7Dir: STM32.64(PC7)
Motor7Speed: STM32.62(PD15)
Motor8Dir: STM32.63(PC6)
Motor8Speed: STM32.61(PD14)
Motor9Dir: STM32.52(PB13)
Motor9Speed: STM32.60(PD13)
Motor10Dir: STM32.51(PB12)
Motor10Speed: STM32.59(PD12)
Motor11Dir: STM32.44(PE13)
Motor11Speed: STM32.42(PE11)
Motor12Dir: STM32.43(PE12)
Motor12Speed: STM32.40(PE9)
nRST: C13.1 JTAG.10 Reset_Button.1 STM32.14(NRST)
SPI2CAN_MISO: R21.2 STM32.79(PC11)
SPI2CAN_MOSI: R20.2 STM32.80(PC12)
SPI2CAN_NSS: R10.2 STM32.29(PA4)
SPI2CAN_SCK: R22.2 STM32.78(PC10)
SPI_MISO: R25.2 STM32.4(PE5)
SPI_MOSI: R24.2 STM32.5(PE6)
SPI_NSS: R26.2 STM32.3(PE4)
SPI_SCK: R27.2 STM32.1(PE2)
TX2_SCL: R16.2 STM32.67(PA8)
TX2_SDA: R23.2 STM32.66(PC9)
NetC11_1: C11.1 STM32.12(PH0-OSC_IN) STM_XTAL.1
NetC12_1: C12.1 STM32.13(PH1-OSC_OUT) STM_XTAL.2
NetC14_1: C14.1 STM32.73(VCAP2)
NetC15_1: C15.1 STM32.48(VCAP1)
NetR28_1: R28.1 STM32.94(BOOT0)

Not connected (* = marked no-connect by the designer): JTAG 7; Reset_Button 2 4; STM32 2(PE3) 7(PC13-ANTI_TAMP) 30(PA5) 35(PB0) 36(PB1) 37(PB2) 41(PE10) 45(PE14) 46(PE15) 47(PB10) 53(PB14) 54(PB15) 55(PD8) 56(PD9) 57(PD10) 58(PD11) 65(PC8) 81(PD0) 82(PD1) 83(PD2) 84(PD3) 85(PD4) 86(PD5) 87(PD6) 88(PD7) 90(PB4) 91(PB5) 95(PB8) 96(PB9) 97(PE0) 98(PE1)

### Notes on the sheet
- Power
- Decoupling Capacitors
- (near JTAG) Pin 7 not connected per JTAG spec
- (near JTAG) JTAG Connector

### Library data of the parts
C11-C19 C31 C32 = 0805C-TBD: as C1 on sheet MotorControl_Sch
JTAG = FTSH-105-01-XXX-D-K: TERMINAL STRIP, .050"(1.27mm) PITCH, 10 PINS, KEYING OPTION.; MANUFACTURER: SAMTEC; CREATED: September 26, 2016 - Wendy Xin; PCB DECAL: FTSH-105-01-XXX-D-K
R10-R28 = 0805R-TBD: RESISTOR 0805 VALUE TO BE DETERMINED
STM32 = STM32F401VCT6: ARM Cortex-M4 32-bit MCU+FPU, 105 DMIPS, 256 kB Flash, 64 kB Internal RAM, 79 I/Os, 100-pin LQFP, -40 to 85 degC, Tray; Manufacturer: STMicroelectronics; FLASH Size (Prog) (kB): 256; I/Os (High Current): 79; Internal RAM Size (kB): 64; Operating Frequency(F) (Processor speed) (MHz): 84; Supply Voltage(Vcc) max (V): 3.6; Supply Voltage(Vcc) min (V): 1.8; DatasheetVersion: Rev. 1; PackageVersion: Rev. 1, 06/2013; PackageReference: LQFP100; PackageDescription: 100-Pin Low Profile Quad Flat Package, 14 x 14 mm Body, 0.5 mm Pitch; Supplier 1: Digi-Key; Supplier Part Number 1: 497-14048-ND; Supplier 2: Newark; Supplier Part Number 2: 19X6223; Supplier 3: Mouser; Supplier Part Number 3: 511-STM32F401VCT6; Core: ARM Cortex-M4; Packing: Tray; Mounting Technology: Surface Mount; PartNumber: STM32F401VCT6; ComponentLink1Description: Manufacturer URL; ComponentLink1URL: http://www.st.com/web/en/home.html; ComponentLink2Description: Datasheet; ComponentLink2URL: http://www.st.com/st-web-ui/static/active/en/resource/technical/document/data_brief/DM00071938.pdf; ComponentLink3Description: Package Specification; ComponentLink3URL: http://www.st.com/st-web-ui/static/active/en/resource/technical/document/data_brief/DM00071938.pdf
STM_XTAL = GC0800044: Diodes Incorporated GC0800044; Supplier 1: Digi-Key; Supplier Part Number 1: GC0800044TR-ND

## Nets that join several sheets
3V3: Instrumentation (GPS.1 GPS.4), MotorControl_Sch (CAN_LevelShifter.1), Power (3.3V_Regulator.5), Sensors_Sch (C30.1 I2C_MUX.20), STM32 Schematic V1 (34 pins)
5V: Instrumentation (5 pins), MotorControl_Sch (11 pins), Power (10 pins), PowerMonitoring (7 pins), Sensors_Sch (26 pins)
12V: Instrumentation (8 pins), MotorControl_Sch (6 pins), Power (6 pins), PowerMonitoring (Current_Transducer_12V.1 Current_Transducer_12V.2 R6.2)
GND: Instrumentation (19 pins), MotorControl_Sch (24 pins), Power (26 pins), PowerMonitoring (14 pins), Sensors_Sch (50 pins), STM32 Schematic V1 (22 pins)
5V_Divider: PowerMonitoring (R7.1 R9.1), Sensors_Sch (AO_ADC.11)
12V_Divider: PowerMonitoring (R6.1 R8.2), Sensors_Sch (AO_ADC.12)
Device_SCL: Instrumentation (IMU.5), Sensors_Sch (Analog_Breakout_ADC.3 AO_ADC.3 Encoder_ADC.3 I2C_MUX.18), STM32 Schematic V1 (R12.2 STM32.92)
Device_SDA: Instrumentation (IMU.4), Sensors_Sch (Analog_Breakout_ADC.2 AO_ADC.2 Encoder_ADC.2 I2C_MUX.19), STM32 Schematic V1 (R13.2 STM32.93)
Fan1: Instrumentation (Fan_Transistors.7), STM32 Schematic V1 (STM32.33)
Fan2: Instrumentation (Fan_Transistors.5), STM32 Schematic V1 (STM32.34)
Fan3: Instrumentation (Fan_Transistors.1), STM32 Schematic V1 (STM32.39)
Fan4: Instrumentation (Fan_Transistors.3), STM32 Schematic V1 (STM32.38)
GPS_FIX: Instrumentation (GPS.6), STM32 Schematic V1 (STM32.71)
GPS_PPS: Instrumentation (GPS.8), STM32 Schematic V1 (STM32.70)
GPS_RX: Instrumentation (GPS.3), STM32 Schematic V1 (R14.2 STM32.69)
GPS_TX: Instrumentation (GPS.7), STM32 Schematic V1 (R15.2 STM32.68)
Motor1Dir: MotorControl_Sch (Signal_MDD10A.1.1), STM32 Schematic V1 (STM32.8)
Motor1Speed: MotorControl_Sch (Signal_MDD10A.1.2), STM32 Schematic V1 (STM32.23)
Motor2Dir: MotorControl_Sch (Signal_MDD10A.1.3), STM32 Schematic V1 (STM32.9)
Motor2Speed: MotorControl_Sch (Signal_MDD10A.1.4), STM32 Schematic V1 (STM32.24)
Motor3Dir: MotorControl_Sch (Signal_MDD10A.2/3.1), STM32 Schematic V1 (STM32.15)
Motor3Speed: MotorControl_Sch (Signal_MDD10A.2/3.2), STM32 Schematic V1 (STM32.25)
Motor4Dir: MotorControl_Sch (Signal_MDD10A.2/3.3), STM32 Schematic V1 (STM32.16)
Motor4Speed: MotorControl_Sch (Signal_MDD10A.2/3.4), STM32 Schematic V1 (STM32.26)
Motor5Dir: MotorControl_Sch (Signal_MDD10A.2/3.6), STM32 Schematic V1 (STM32.17)
Motor5Speed: MotorControl_Sch (Signal_MDD10A.2/3.7), STM32 Schematic V1 (STM32.31)
Motor6Dir: MotorControl_Sch (Signal_MDD10A.2/3.8), STM32 Schematic V1 (STM32.18)
Motor6Speed: MotorControl_Sch (Signal_MDD10A.2/3.9), STM32 Schematic V1 (STM32.32)
Motor7Dir: MotorControl_Sch (Signal_MDD10A.4.1), STM32 Schematic V1 (STM32.64)
Motor7Speed: MotorControl_Sch (Signal_MDD10A.4.2), STM32 Schematic V1 (STM32.62)
Motor8Dir: MotorControl_Sch (Signal_MDD10A.4.3), STM32 Schematic V1 (STM32.63)
Motor8Speed: MotorControl_Sch (Signal_MDD10A.4.4), STM32 Schematic V1 (STM32.61)
Motor9Dir: MotorControl_Sch (Signal_MDD10A.5/6.1), STM32 Schematic V1 (STM32.52)
Motor9Speed: MotorControl_Sch (Signal_MDD10A.5/6.2), STM32 Schematic V1 (STM32.60)
Motor10Dir: MotorControl_Sch (Signal_MDD10A.5/6.3), STM32 Schematic V1 (STM32.51)
Motor10Speed: MotorControl_Sch (Signal_MDD10A.5/6.4), STM32 Schematic V1 (STM32.59)
Motor11Dir: MotorControl_Sch (Signal_MDD10A.5/6.6), STM32 Schematic V1 (STM32.44)
Motor11Speed: MotorControl_Sch (Signal_MDD10A.5/6.7), STM32 Schematic V1 (STM32.42)
Motor12Dir: MotorControl_Sch (Signal_MDD10A.5/6.8), STM32 Schematic V1 (STM32.43)
Motor12Speed: MotorControl_Sch (Signal_MDD10A.5/6.9), STM32 Schematic V1 (STM32.40)
SPI2CAN_MISO: MotorControl_Sch (CAN_LevelShifter.3), STM32 Schematic V1 (R21.2 STM32.79)
SPI2CAN_MOSI: MotorControl_Sch (CAN_LevelShifter.4), STM32 Schematic V1 (R20.2 STM32.80)
SPI2CAN_NSS: MotorControl_Sch (CAN_LevelShifter.2), STM32 Schematic V1 (R10.2 STM32.29)
SPI2CAN_SCK: MotorControl_Sch (CAN_LevelShifter.5), STM32 Schematic V1 (R22.2 STM32.78)
SPI_MISO: Sensors_Sch (SPI.5), STM32 Schematic V1 (R25.2 STM32.4)
SPI_MOSI: Sensors_Sch (SPI.6), STM32 Schematic V1 (R24.2 STM32.5)
SPI_NSS: Sensors_Sch (SPI.4), STM32 Schematic V1 (R26.2 STM32.3)
SPI_SCK: Sensors_Sch (SPI.3), STM32 Schematic V1 (R27.2 STM32.1)
TX2_SCL: Sensors_Sch (TX2_I2C.2), STM32 Schematic V1 (R16.2 STM32.67)
TX2_SDA: Sensors_Sch (TX2_I2C.1), STM32 Schematic V1 (R23.2 STM32.66)
VIOUT_5V: PowerMonitoring (C7.1 Current_Transducer_5V.7), Sensors_Sch (AO_ADC.9)
VIOUT_12V: PowerMonitoring (C8.1 Current_Transducer_12V.7), Sensors_Sch (AO_ADC.10)